# Altium schematic sheet BuckDC_33.SchDoc
size A; SheetNumber: 2; SheetTotal: 3
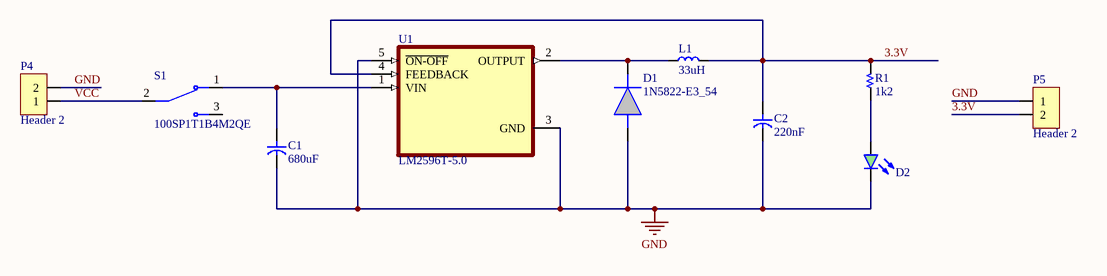
[diagram p0: BuckDC_33.SchDoc]

## Parts
C1  680uF  [CAP/D80/H125/LS35]
C2  220nF  [CAP/D80/H125/LS35]
D1  1N5822-E3_54  [DIOAD2855W132L835D505]
D2  LED GREEN  [LED 10MM - GREEN]  (value not drawn)
L1  33uH  [R 1/4W]
P4  Header 2  [HDR/Terminal/2]
P5  Header 2  [HDR/Terminal/2]
R1  1k2  [R 1/4W/300]
S1  100SP1T1B4M2QE  [SW_100SP1T1B4M2QE]
U1  LM2596T-5.0  [TO170P1016X470X2092-5]

## Nets
GND: C1.2 C2.2 D1.1(A) D2.2(K) P4.2 P5.1 U1.3(GND) U1.5(~{ON-OFF})
3.3V: C2.1 L1.2 P5.2 R1.2 U1.4(FEEDBACK)
VCC: P4.1 S1.2
NetC1_1: C1.1 S1.1 U1.1(VIN)
NetD1_2: D1.2(K) L1.1 U1.2(OUTPUT)
NetD2_1: D2.1(A) R1.1

Not connected (* = marked no-connect by the designer): S1 3

## Library data of the parts
C1 C2 = Capacitor: Capacitor pol
D1 = 1N5822-E3_54: VISHAY - 1N5822-E3/54 - Schottky Rectifier, 40 V, 3 A, Single, DO-201AD, 2 Pins, 525 mV; Manufacturer_Name: Vishay; Manufacturer_Part_Number: 1N5822-E3/54; Mouser Part Number: 625-1N5822-E3; Mouser Price/Stock: https://www.mouser.co.uk/ProductDetail/Vishay-General-Semiconductor/1N5822-E3-54?qs=7w0fSgRKp92xXX1kfLSISA%3D%3D; Arrow Part Number: 1N5822-E3/54; Arrow Price/Stock: https://www.arrow.com/en/products/1n5822-e354/vishay?utm_currency=USD&region=nac; Datasheet Link: https://4donline.ihs.com/images/VipMasterIC/IC/VISH/VISH-S-A0001809980/VISH-S-A0001809988-1.pdf?hkey=6D3A4C79FDBF58556ACFDE234799DDF0
D2 = LED GREEN: Typical LED 3-pin 2-color
L1 = Inductor
P4 P5 = Header 2: Header, 2-Pin
R1 = Resistor
S1 = 100SP1T1B4M2QE: Toggle Switch SPDT Through Hole; Package: None; Price: None; Value: *; MP: 100SP1T1B4M2QE; Availability: Unavailable
U1 = LM2596T-5.0: SIMPLE SWITCHERÂ® 4.5V to 40V, 3A Low Component Count Step-Down Regulator 5-TO-220; MF: Texas Instruments; SnapEDA_Link: https://www.snapeda.com/parts/LM2596T-5.0/Texas+Instruments/view-part/?ref=snap; Package: TO-220-5 Texas Instruments; Value: *; MP: LM2596T-5.0; Check_prices: https://www.snapeda.com/parts/LM2596T-5.0/Texas+Instruments/view-part/?ref=eda